# EAGLE design M135X (EAGLE 4.11)
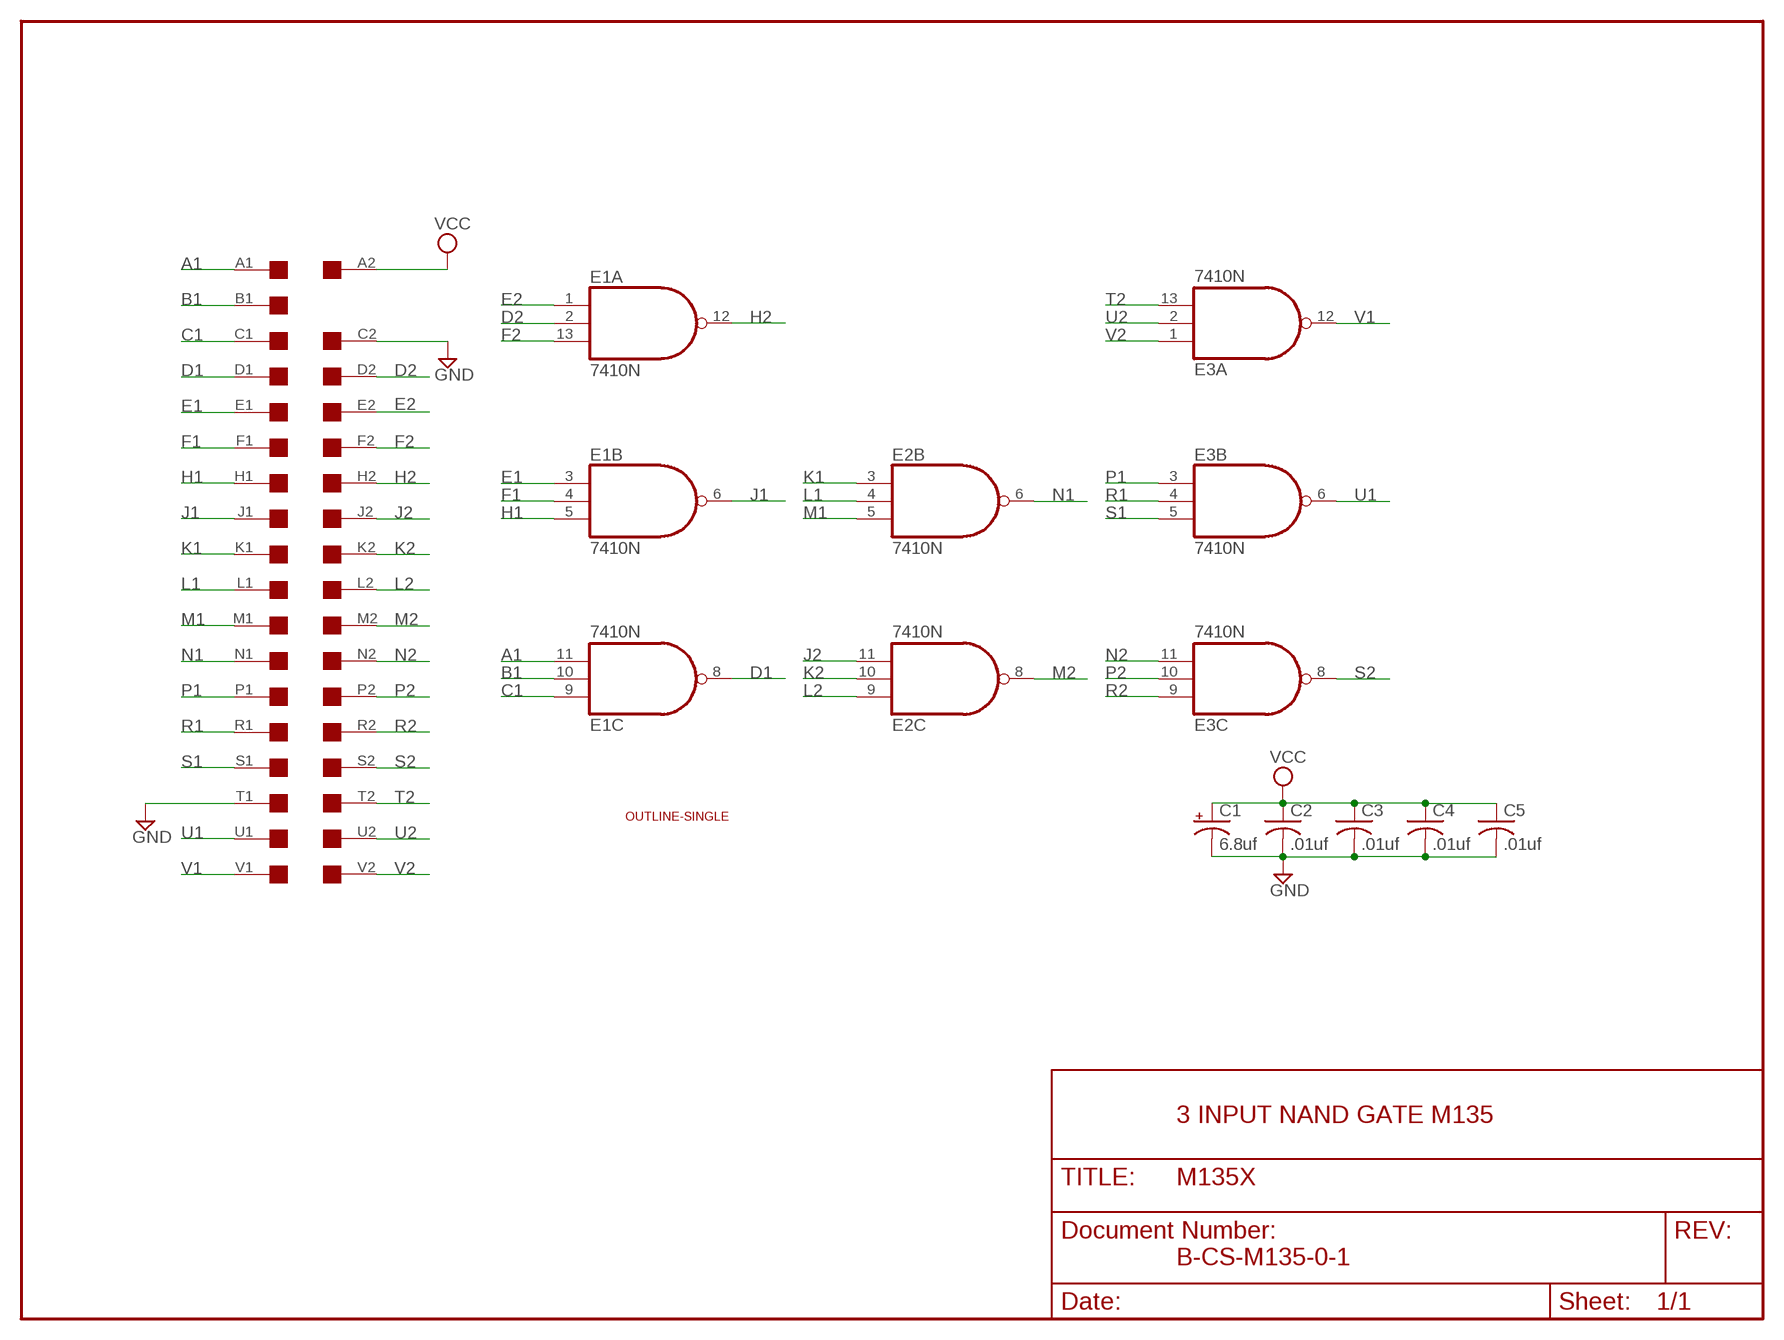
[diagram p0: schematic, sheet 1]

## Parts
C1  6.8uf  CPOL-USE15-5AXIAL  [E15-5]
C2  .01uf  C-US050-025X075  [C050-025X075]
C3  .01uf  C-US050-025X075  [C050-025X075]
C4  .01uf  C-US050-025X075  [C050-025X075]
C5  .01uf  C-US050-025X075  [C050-025X075]
E1  7410N  [DIL14]
E2  7410N  [DIL14]
E3  7410N  [DIL14]
U$1  SINGLE  [EDGE-CON2]
U$4  OUTLINE-SINGLE  [SINGLE]

## Nets
A1: E1.11(C:I2) U$1.A1
B1: E1.10(C:I1) U$1.B1
C1: E1.9(C:I0) U$1.C1
D1: E1.8(C:O) U$1.D1
D2: E1.2(A:I1) U$1.D2
E1: E1.3(B:I0) U$1.E1
E2: E1.1(A:I0) U$1.E2
F1: E1.4(B:I1) U$1.F1
F2: E1.13(A:I2) U$1.F2
GND [Supply]: C1.- C2.2 C3.2 C4.2 C5.2 U$1.C2 U$1.T1
H1: E1.5(B:I2) U$1.H1
H2: E1.12(A:O) U$1.H2
J1: E1.6(B:O) U$1.J1
J2: E2.11(C:I2) U$1.J2
K1: E2.3(B:I0) U$1.K1
K2: E2.10(C:I1) U$1.K2
L1: E2.4(B:I1) U$1.L1
L2: E2.9(C:I0) U$1.L2
M1: E2.5(B:I2) U$1.M1
M2: E2.8(C:O) U$1.M2
N1: E2.6(B:O) U$1.N1
N2: E3.11(C:I2) U$1.N2
P1: E3.3(B:I0) U$1.P1
P2: E3.10(C:I1) U$1.P2
R1: E3.4(B:I1) U$1.R1
R2: E3.9(C:I0) U$1.R2
S1: E3.5(B:I2) U$1.S1
S2: E3.8(C:O) U$1.S2
T2: E3.13(A:I2) U$1.T2
U1: E3.6(B:O) U$1.U1
U2: E3.2(A:I1) U$1.U2
V1: E3.12(A:O) U$1.V1
V2: E3.1(A:I0) U$1.V2
VCC [Supply]: C1.+ C2.1 C3.1 C4.1 C5.1 U$1.A2
Unconnected: E2.1(A:I0) E2.2(A:I1) E2.12(A:O) E2.13(A:I2) U$1.B2

## Notes on the sheet
- 3 INPUT NAND GATE M135
- B-CS-M135-0-1

## Power pins joined to a net without a drawn wire
GND: E1.7(P:GND) E2.7(P:GND) E3.7(P:GND)
VCC: E1.14(P:VCC) E2.14(P:VCC) E3.14(P:VCC)

## Library data of the parts
C1 = rcl:CPOL-US: POLARIZED CAPACITOR, American symbol
C2-C5 = rcl:C-US: CAPACITOR, American symbol
E1-E3 = 74xx-us:74*10: Triple 3-input NAND gate
U$1 = dec-con:SINGLE: Single-Height DEC board
U$4 = dec-con:OUTLINE-*: Board outlines for DEC boards.

## Net classes
1 Supply: width 0.813 mm

## Board
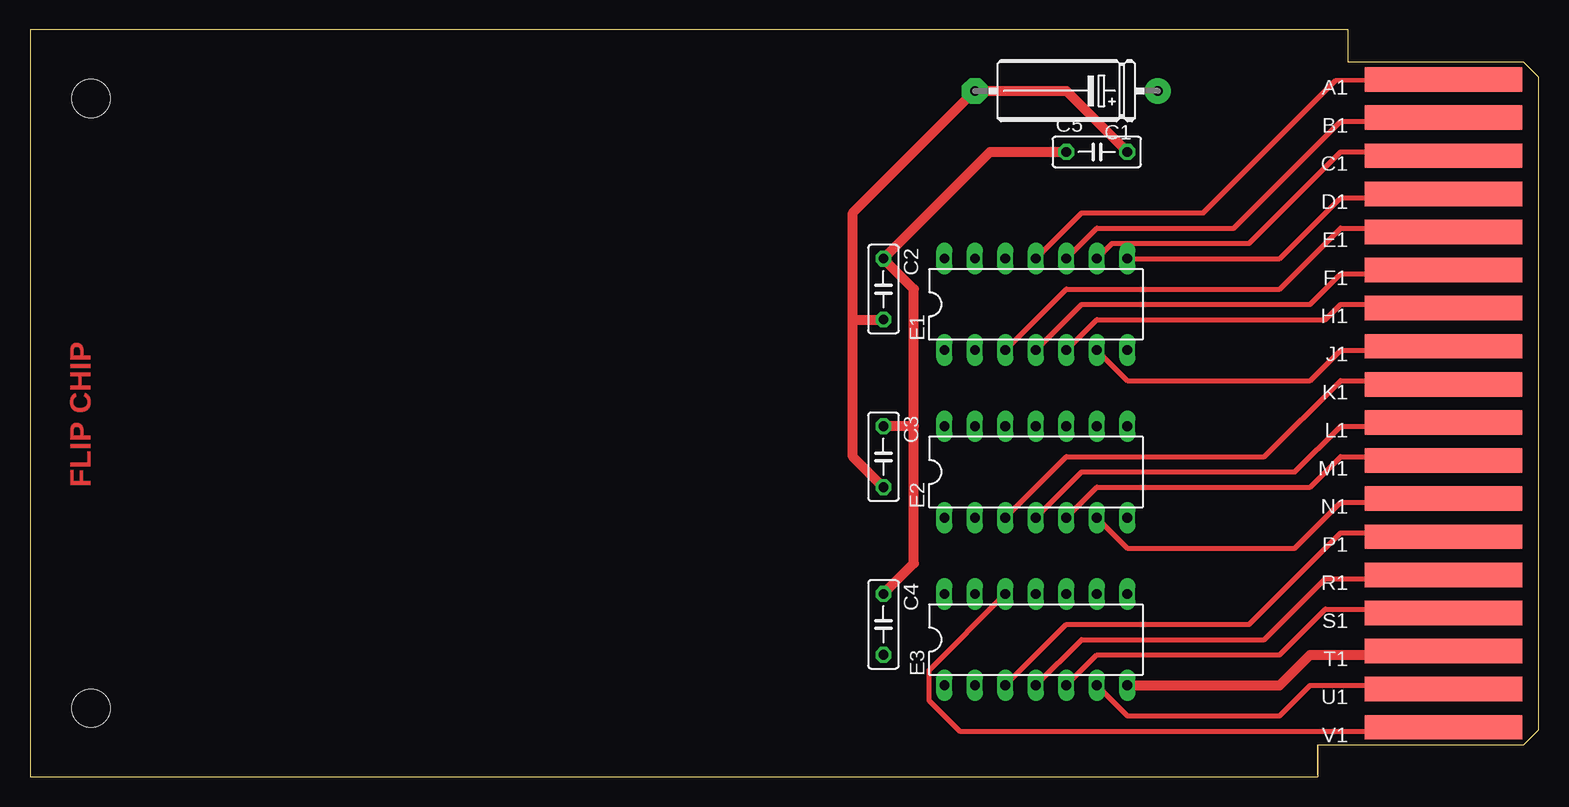
[diagram p1: board, top side]
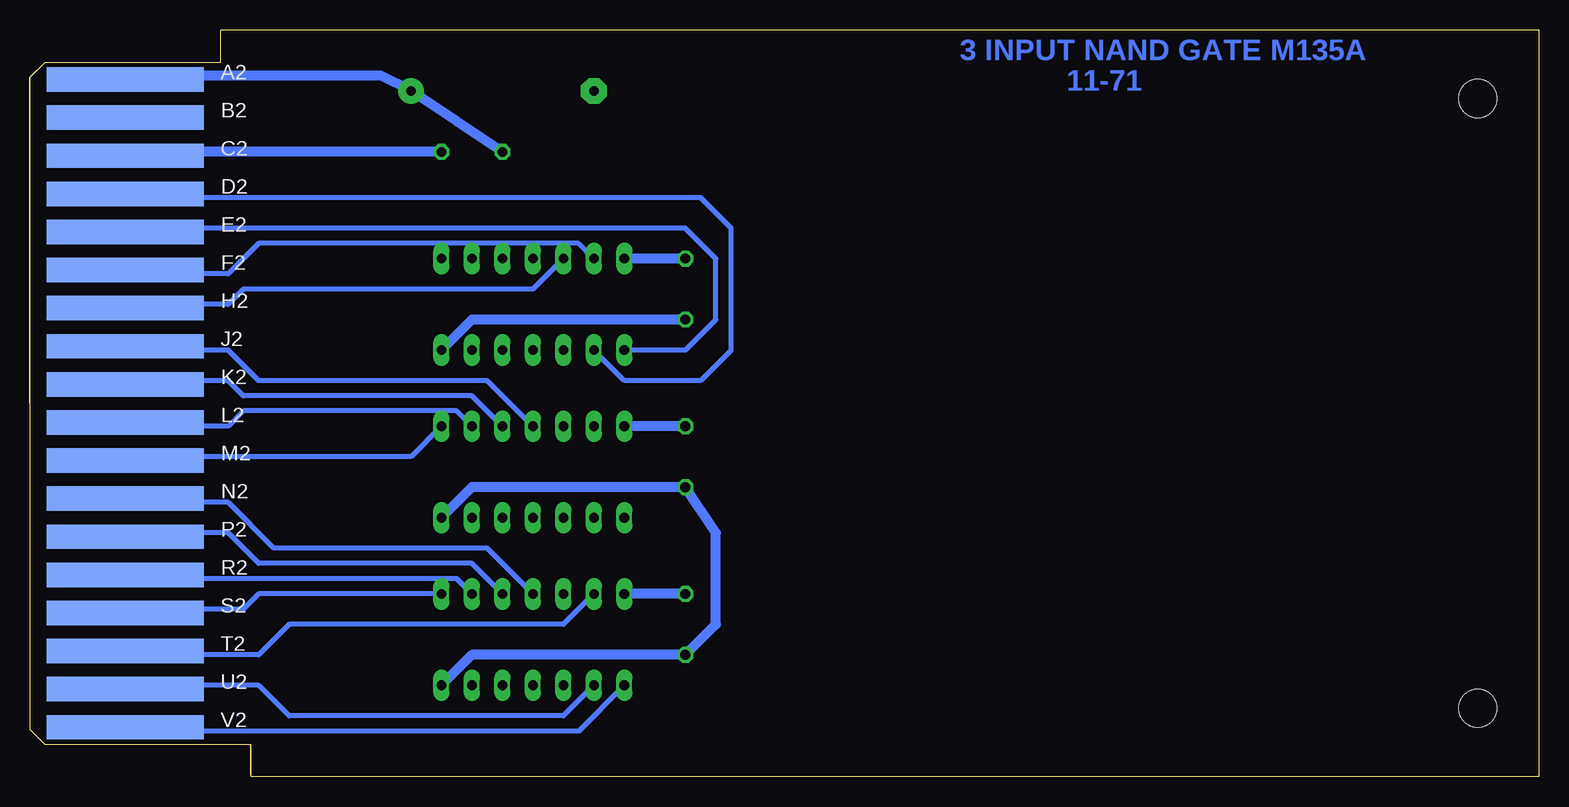
[diagram p2: board, bottom side, seen from below]

Size 125.73 x 62.23 mm. Coordinates in mm from the lower left corner, seen from the top.
Copper layers (1+16): Top 0.035mm / dielectric 1.5mm / Bottom 0.035mm
Design rules "16mils": minimum track width 16mil, minimum drill 32mil, track to track 15mil, track to pad 10mil, pad to pad 10mil, via to via 10mil, smd to smd 10mil, copper to edge 13mil, drill to drill 10mil, minimum pad ring 10mil, minimum via ring 8mil, stop-mask expansion 0mil, vias tented up to drill 0mil, thermal gap 10mil

### Footprints (pad centres in the part's own frame; a part is rotated, then mirrored left to right if it is on the bottom)
E15-5 = drill 0.813 pad 2.159: + -7.62,0 | drill 0.813 pad 2.159 octagon: - 7.62,0
C050-025X075 = drill 0.813 octagon: 1 -2.54,0; 2 2.54,0
DIL14 = drill 0.813 long: 1 -7.62,-3.81; 2 -5.08,-3.81; 3 -2.54,-3.81; 4 0,-3.81; 5 2.54,-3.81; 6 5.08,-3.81; 7 7.62,-3.81; 8 7.62,3.81; 9 5.08,3.81; 10 2.54,3.81; 11 0,3.81; 12 -2.54,3.81; 13 -5.08,3.81; 14 -7.62,3.81
EDGE-CON2 = smd 13.106 x 2.032: A1 7.938,4.128; B1 7.938,7.303; C1 7.938,10.477; D1 7.938,13.652; E1 7.938,16.828; F1 7.938,20.003; H1 7.938,23.177; J1 7.938,26.352; K1 7.938,29.527; L1 7.938,32.703; M1 7.938,35.877; N1 7.938,39.053; P1 7.938,42.227; R1 7.938,45.403; S1 7.938,48.578; T1 7.938,51.752; U1 7.938,54.928; V1 7.938,58.102 | smd 13.106 x 2.032 bottom: A2 7.938,4.128; B2 7.938,7.303; C2 7.938,10.477; D2 7.938,13.652; E2 7.938,16.828; F2 7.938,20.003; H2 7.938,23.177; J2 7.938,26.352; K2 7.938,29.527; L2 7.938,32.703; M2 7.938,35.877; N2 7.938,39.053; P2 7.938,42.227; R2 7.938,45.403; S2 7.938,48.578; T2 7.938,51.752; U2 7.938,54.928; V2 7.938,58.102
SINGLE = hole 3.175: 120.65,56.515; 120.65,5.715

### Placement (x,y rotation side)
C1  86.36,57.15 180 top
C2  71.12,40.64 270 top
C3  71.12,26.67 270 top
C4  71.12,12.7 270 top
C5  88.9,52.07 0 top
E1  83.82,39.37 0 top
E2  83.82,25.4 0 top
E3  83.82,11.43 0 top
U$1  125.73,62.23 180 top
U$4  125.73,62.23 180 top

### Tracks (layer width: path | path; a pad name or v marks a point on that pad's centre or on a via)
A1
  Top 0.406: U$1.A1 108.82,58.02 97.79,46.99 87.63,46.99 E1.11
B1
  Top 0.406: U$1.B1 112.05,54.9 111.76,54.61 109.22,54.61 100.33,45.72 88.9,45.72 E1.10
C1
  Top 0.406: U$1.C1 112.09,51.74 111.76,52.07 109.22,52.07 101.6,44.45 90.17,44.45 E1.9
D1
  Top 0.406: U$1.D1 112.06,48.56 111.76,48.26 109.22,48.26 104.14,43.18 E1.8
D2
  Bottom 0.406: U$1.D2 112.06,48.56 111.76,48.26 69.85,48.26 67.31,45.72 67.31,35.56 69.85,33.02 76.2,33.02 E1.2
E1
  Top 0.406: E1.3 86.36,40.64 104.14,40.64 109.22,45.72 111.76,45.72 112.09,45.39 U$1.E1
E2
  Bottom 0.406: U$1.E2 112.09,45.39 111.76,45.72 71.12,45.72 68.58,43.18 68.58,38.1 71.12,35.56 E1.1
F1
  Top 0.406: E1.4 87.63,39.37 106.68,39.37 109.22,41.91 111.76,41.91 112.04,42.19 U$1.F1
F2
  Bottom 0.406: E1.13 80.01,44.45 106.68,44.45 109.22,41.91 111.76,41.91 112.04,42.19 U$1.F2
GND
  Top 0.813: C5.2 86.36,57.15 C1.- 68.58,46.99 68.58,38.1 | 68.58,38.1 C2.2 | C3.2 68.58,26.67 68.58,38.1 | U$1.T1 111.76,10.16 106.68,10.16 104.14,7.62 E3.7
  Bottom 0.813: E3.7 88.9,10.16 C4.2 68.58,12.7 68.58,20.32 C3.2 88.9,24.13 E2.7 | E1.7 88.9,38.1 C2.2 | U$1.C2 112.09,51.74 111.76,52.07 C5.2
H1
  Top 0.406: E1.5 88.9,38.1 107.95,38.1 109.22,39.37 111.76,39.37 112.09,39.04 U$1.H1
H2
  Bottom 0.406: E1.12 83.82,40.64 107.95,40.64 109.22,39.37 111.76,39.37 112.09,39.04 U$1.H2
J1
  Top 0.406: U$1.J1 112.09,35.89 111.76,35.56 109.22,35.56 106.68,33.02 91.44,33.02 E1.6
J2
  Bottom 0.406: U$1.J2 112.09,35.89 111.76,35.56 109.22,35.56 106.68,33.02 87.63,33.02 E2.11
K1
  Top 0.406: E2.3 86.36,26.67 102.87,26.67 109.22,33.02 111.76,33.02 112.06,32.72 U$1.K1
K2
  Bottom 0.406: U$1.K2 112.06,32.72 111.76,33.02 109.22,33.02 107.95,31.75 88.9,31.75 E2.10
L1
  Top 0.406: E2.4 87.63,25.4 105.41,25.4 109.22,29.21 111.76,29.21 112.09,29.54 U$1.L1
L2
  Bottom 0.406: U$1.L2 112.09,29.54 111.76,29.21 109.22,29.21 107.95,30.48 90.17,30.48 E2.9
M1
  Top 0.406: E2.5 88.9,24.13 106.68,24.13 109.22,26.67 111.76,26.67 112.09,26.34 U$1.M1
M2
  Bottom 0.406: U$1.M2 112.09,26.34 111.76,26.67 93.98,26.67 E2.8
N1
  Top 0.406: U$1.N1 112.09,23.19 111.76,22.86 109.22,22.86 105.41,19.05 91.44,19.05 E2.6
N2
  Bottom 0.406: U$1.N2 112.09,23.19 111.76,22.86 109.22,22.86 105.41,19.05 87.63,19.05 E3.11
P1
  Top 0.406: U$1.P1 112.09,19.99 111.76,20.32 109.22,20.32 101.6,12.7 86.36,12.7 E3.3
P2
  Bottom 0.406: U$1.P2 112.09,19.99 111.76,20.32 109.22,20.32 106.68,17.78 88.9,17.78 E3.10
R1
  Top 0.406: U$1.R1 112.09,16.84 111.76,16.51 107.95,16.51 102.87,11.43 87.63,11.43 E3.4
R2
  Bottom 0.406: U$1.R2 112.09,16.84 111.76,16.51 90.17,16.51 E3.9
S1
  Top 0.406: U$1.S1 117.78,13.97 107.95,13.97 104.14,10.16 88.9,10.16 E3.5
S2
  Bottom 0.406: U$1.S2 112.06,13.66 111.76,13.97 107.95,13.97 106.68,15.24 E3.8
T2
  Bottom 0.406: E3.13 81.28,12.7 104.14,12.7 106.68,10.16 111.76,10.16 112.09,10.49 U$1.T2
U1
  Top 0.406: U$1.U1 112.12,7.26 111.76,7.62 106.68,7.62 104.14,5.08 91.44,5.08 E3.6
U2
  Bottom 0.406: E3.2 81.28,5.08 104.14,5.08 106.68,7.62 111.76,7.62 112.12,7.26 U$1.U2
V1
  Top 0.406: U$1.V1 112.15,4.2 111.76,3.81 77.47,3.81 74.93,6.35 74.93,8.89 E3.12
V2
  Bottom 0.406: E3.1 80.01,3.81 111.76,3.81 112.15,4.2 U$1.V2
VCC
  Top 0.813: C5.1 80.01,52.07 C2.1 73.66,40.64 73.66,29.21 | 73.66,29.21 73.66,17.78 C4.1 | 73.66,29.21 C3.1
  Bottom 0.813: U$1.A2 111.76,58.02 111.76,58.42 96.52,58.42 C1.+ C5.1 | C2.1 E1.14 | C3.1 E2.14 | C4.1 E3.14

### Text on the board
Top: FLIP CHIP
Bottom: 3 INPUT NAND GATE M135A | 11-71